# EAGLE design Atomic_V1.0 (EAGLE 9.6.2)
Assembly variants: ECU Type I non terminated

## Sheet 1 of 3
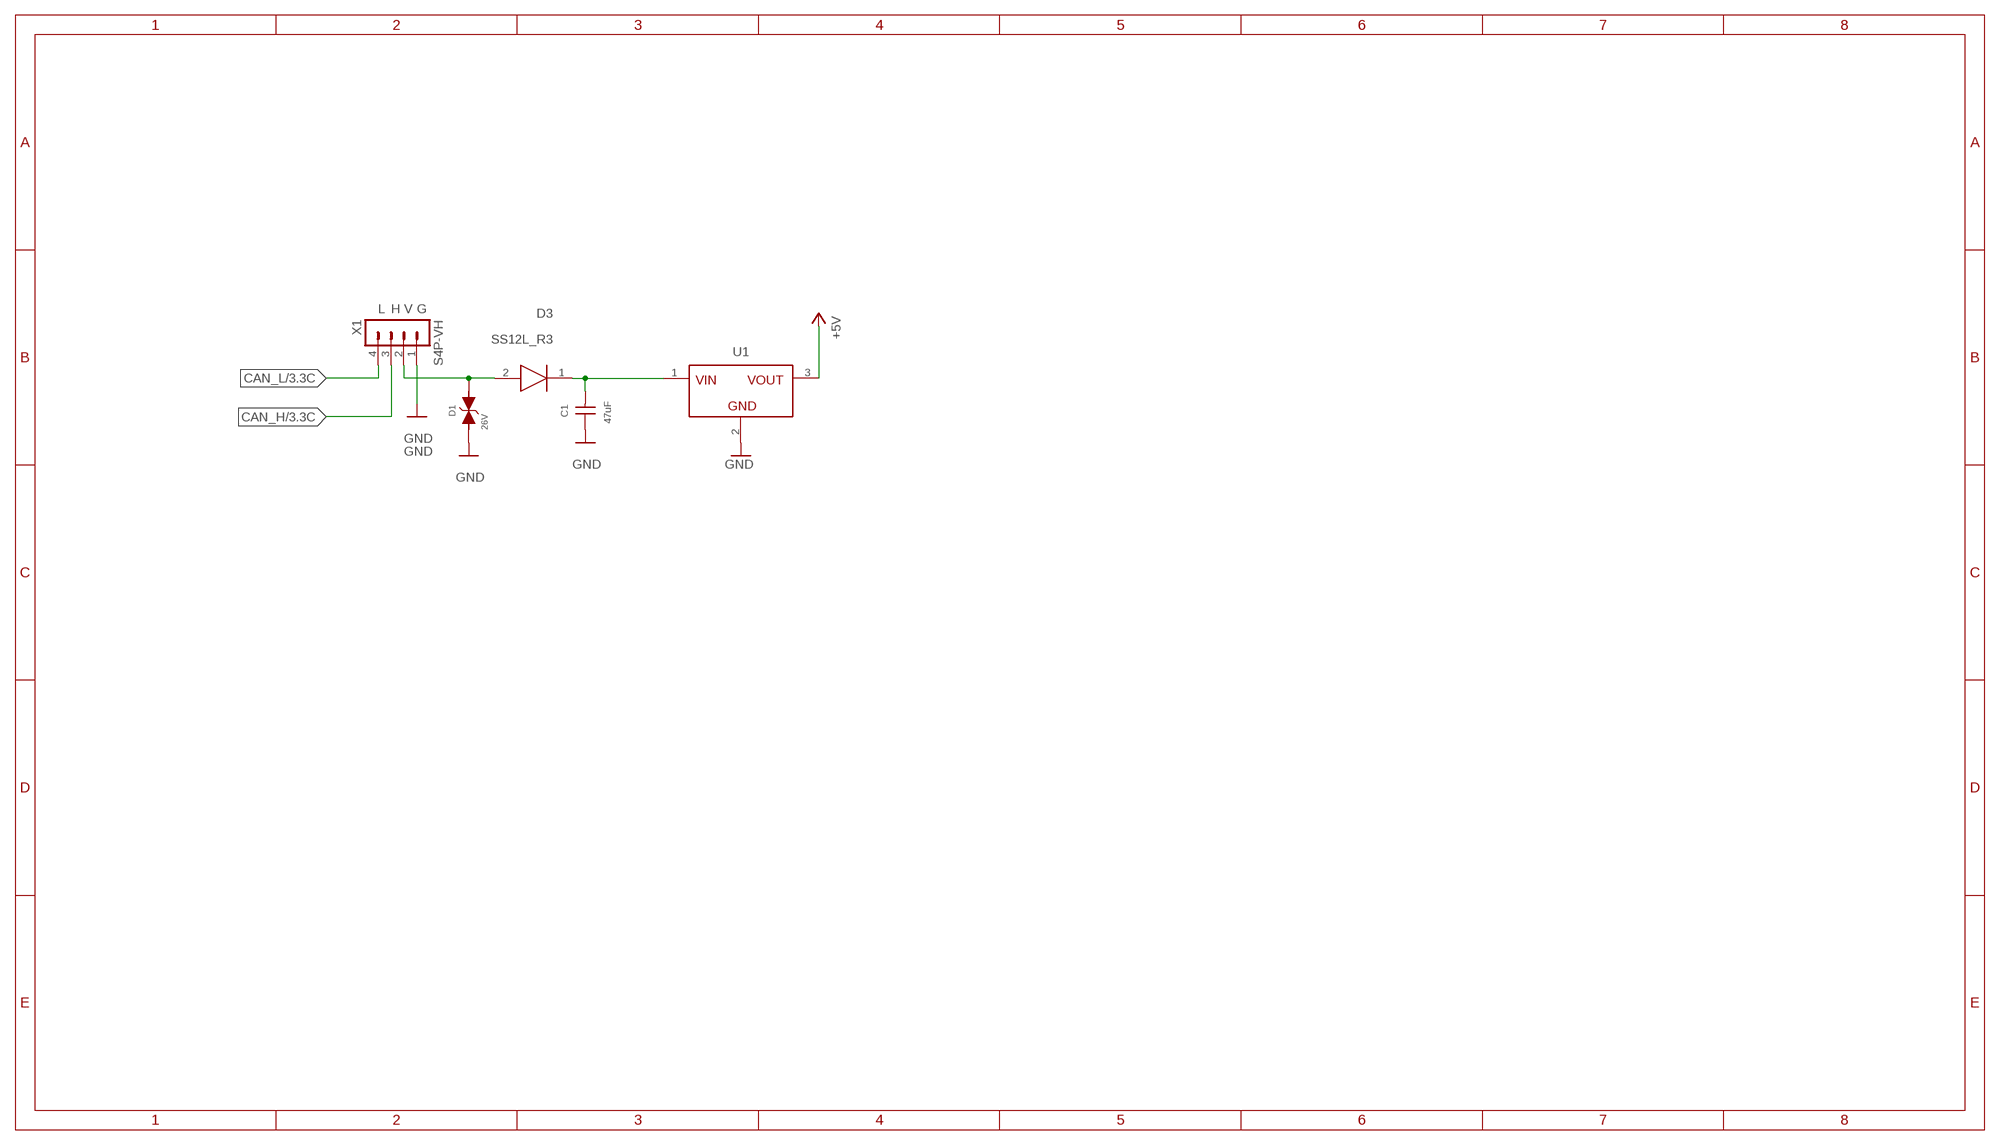
[diagram p0: schematic, sheet 1]

### Parts
C1  47uF  WCAP-CSGP_1210_H2.5_885012109014_25V(DC)  [WCAP-CSGP_1210_H2.5]
D1  26V  WE-TVSP_DO-214AC_400W_BI_824501261  [WE-TVSP_DO-214AC_BIDIRECTIONAL]
D3  SS12L_R3  [SODFL3618X143N]
U1  MAGI³C-FDSM_SIP-3_173010542_173XXXX42  [MAGI³C-FDSM_173XXXX42]
X1  S4P-VH  [S4P-VH]

### Nets
+5V: U1.3(VOUT) ; also sheet 2,3
+12V: D1.2 D3.2(A) X1.2
CAN_H: X1.3 ; also sheet 3
CAN_L: X1.4 ; also sheet 3
GND [GND]: C1.1 D1.1 U1.2(GND) X1.1 ; also sheet 2,3
N$1: C1.2 D3.1(K) U1.1(VIN)

### Notes on the sheet
- L | H | V | G

## Sheet 2 of 3
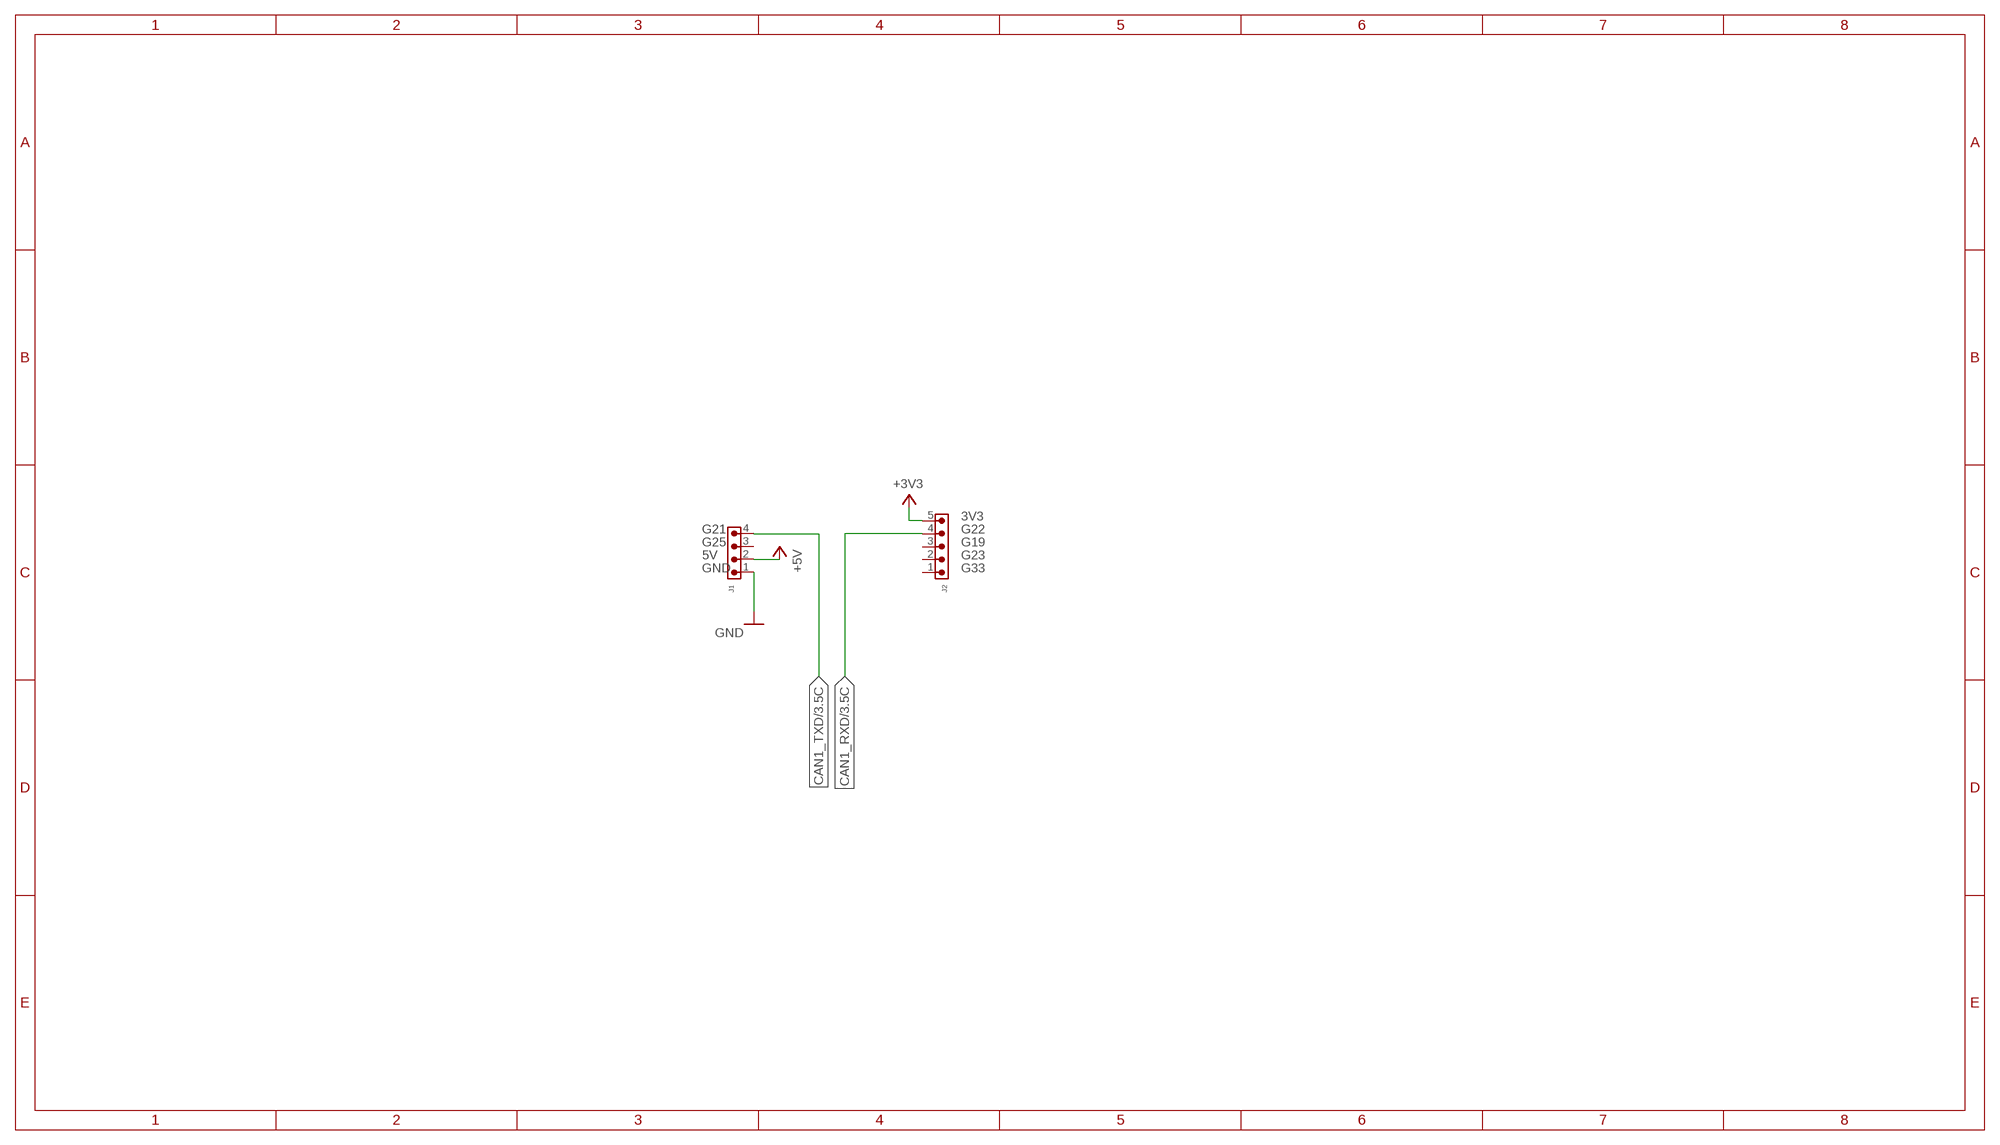
[diagram p1: schematic, sheet 2]

### Parts
J1  6130XX11121_61300411121  [61300411121]
J2  6130XX11121_61300511121  [61300511121]

### Nets
+3V3: J2.5 ; also sheet 3
+5V: J1.2 ; also sheet 1,3
CAN1_RXD: J2.4 ; also sheet 3
CAN1_TXD: J1.4 ; also sheet 3
GND [GND]: J1.1 ; also sheet 1,3
Unconnected: J1.3 J2.1 J2.2 J2.3

### Notes on the sheet
- 3V3
- G21 | G22
- G25 | G19
- 5V | G23
- GND | G33

## Sheet 3 of 3
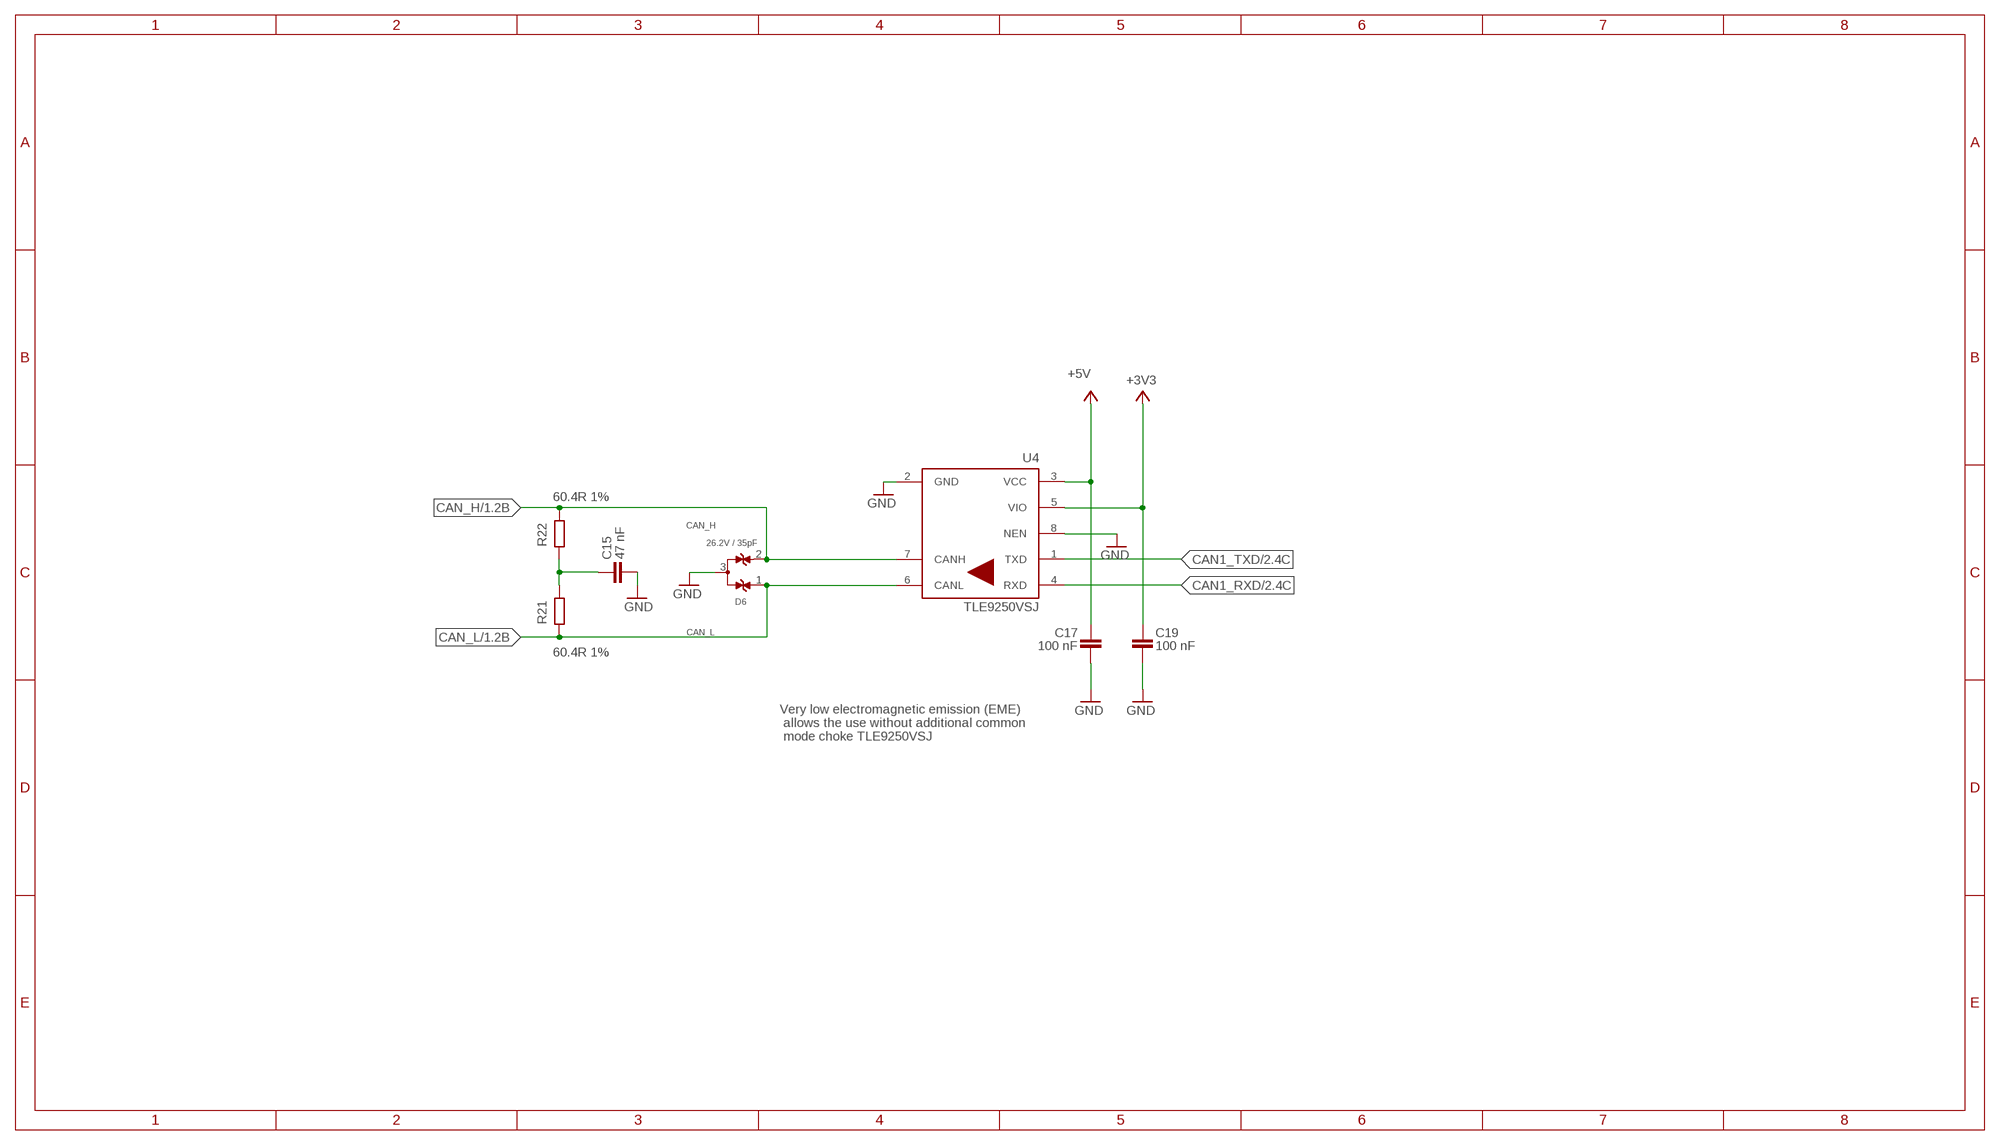
[diagram p2: schematic, sheet 3]

### Parts
C15  47 nF  WCAP-CSGP_0402_885012205054_25V(DC)  [WCAP-CSGP_0402]
C17  100 nF  WCAP-CSGP_0402_885012205037_16V(DC)  [WCAP-CSGP_0402]
C19  100 nF  WCAP-CSGP_0402_885012205037_16V(DC)  [WCAP-CSGP_0402]
D6  26.2V / 35pF  WE-TVS_SOT23-3L_824098024  [WE-TVS_SOT23-3L]
R21  60.4R 1%  R-0402_60.4OHMS_1%_AEC-Q200  [WCAP-CSRF_0402]  (not fitted in variant ECU Type I non terminated)
R22  60.4R 1%  R-0402_60.4OHMS_1%_AEC-Q200  [WCAP-CSRF_0402]  (not fitted in variant ECU Type I non terminated)
U4  TLE9250VSJ  [SOIC127P602X173-8N-V]

### Nets
+3V3: C19.1 U4.5(VIO) ; also sheet 2
+5V: C17.1 U4.3(VCC) ; also sheet 1,2
CAN1_RXD: U4.4(RXD) ; also sheet 2
CAN1_TXD: U4.1(TXD) ; also sheet 2
CAN_H: D6.2 R22.2 U4.7(CANH) ; also sheet 1
CAN_L: D6.1 R21.1 U4.6(CANL) ; also sheet 1
GND [GND]: C15.2 C17.2 C19.2 D6.3 U4.2(GND) U4.8(NEN) ; also sheet 1,2
N$17: C15.1 R21.2 R22.1

### Notes on the sheet
- Very low electromagnetic emission (EME)
   allows the use without additional common
   mode choke TLE9250VSJ

## Library data of the parts
C1 = Wurth_Capacitors_WCAP-CSGP:WCAP-CSGP_1210_H2.5: WCAP-CSGP MLCCs 1210 General Purpose Characteristics General purpose product series High performance ceramic High electrical precision and stability ceramic especially for NP0 Minimal aging especially for NP0 Mounting style: SMT-Chip Ceramic: NP0 (Class I), X5R (Class II), X7R (Class II) Capacitance range: 22 pF ‒ 100 µF Temperature Coefficient: ±30 ppm/°C; ±0.54 % for NP0 ±15 % for X7R and X5R Voltage range (UR): 6.3 ‒ 100 V(DC) Operating temperature: -55 °C up to + 125 °C for NP0 and X7R -55 °C up to + 85 °C for X5R Termination: Cu/Ni/Sn Recommended soldering: Reflow soldering Applications Temperature compensation (NP0) Coupling Decoupling Bypass Smoothing Filtering Resonant circuit <https://www.we-online.com/catalog/media/o166502v209%20Family_WE-MLCC_1210.jpg> Details see: https://www.we-online.com/catalog/en/WCAP-CSGP-1210/ Updated by yingchun,Shan;2020-03-09 2020(C) Würth Elektronik; CERAMIC-TYPE: X5R Class II; DATASHEET-URL: https://www.we-online.com/catalog/datasheet/885012109014.pdf; DF: 0.05; H: 2.5mm; OPERATING-TEMPERATURE: -55 °C up to +85 °C; PART-NUMBER: 885012109014; QMIN: -; RISO: 0,005G Ohm; TECHNICAL-REFERENCE: X5R1210226M025DFCT10000; TOL-VALUE: ±20%; VALUE: 22µF; VR: 25V(DC)
C15 = fliegl-wuerth:WCAP-CSGP_0402: WCAP-CSGP MLCCs 0402 General Purpose Characteristics High performance ceramic High electrical precision and stability ceramic especially for NP0 Minimal aging especially for NP0 Mounting style: SMT-Chip Ceramic: NP0 (Class I), X5R (Class II), X7R (Class II) Capacitance range: 1 pF ‒ 10 µF Temperature Coefficient: ±30 ppm/°C; ±0.54 % for NP0 ±15 % for X5R and X7R Voltage range (UR): 6.3 ‒ 100 V(DC) Operating temperature: -55 °C up to + 125 °C for NP0 and X7R -55 °C up to + 85 °C for X5R Termination: Cu/Ni/Sn Recommended soldering: Reflow soldering Applications Temperature compensation (NP0) Coupling Decoupling Bypass Smoothing Filtering Resonant circuit <https://www.we-online.com/catalog/media/o157810v209%20Family_WE-MLCC_0805_weiss.jpg> Details see: https://www.we-online.com/catalog/en/WCAP-CSGP-0402/ Updated by yingchun,Shan;2020-03-06 2020(C) Würth Elektronik; ARTIKEL_NR: 545508; CERAMIC-TYPE: X7R Class II; PART-NUMBER: 885012205054; TOL-VALUE: ±10%; VR: 25V(DC)
C17 C19 = fliegl-wuerth:WCAP-CSGP_0402: WCAP-CSGP MLCCs 0402 General Purpose Characteristics High performance ceramic High electrical precision and stability ceramic especially for NP0 Minimal aging especially for NP0 Mounting style: SMT-Chip Ceramic: NP0 (Class I), X5R (Class II), X7R (Class II) Capacitance range: 1 pF ‒ 10 µF Temperature Coefficient: ±30 ppm/°C; ±0.54 % for NP0 ±15 % for X5R and X7R Voltage range (UR): 6.3 ‒ 100 V(DC) Operating temperature: -55 °C up to + 125 °C for NP0 and X7R -55 °C up to + 85 °C for X5R Termination: Cu/Ni/Sn Recommended soldering: Reflow soldering Applications Temperature compensation (NP0) Coupling Decoupling Bypass Smoothing Filtering Resonant circuit <https://www.we-online.com/catalog/media/o157810v209%20Family_WE-MLCC_0805_weiss.jpg> Details see: https://www.we-online.com/catalog/en/WCAP-CSGP-0402/ Updated by yingchun,Shan;2020-03-06 2020(C) Würth Elektronik; ARTIKEL_NR: 545504; CERAMIC-TYPE: X7R Class II; PART-NUMBER: 885012205037; TOL-VALUE: ±10%; VR: 16V(DC)
D1 = Wurth_EMC Components_WE-TVSP:WE-TVSP_DO-214AC_400W_BI: WE-TVSP Power TVS Diode Characteristics Low Profile Package Glass passivated Juction Excellent clamping capability Fast response time MSL Level 1, per J-STD-020 Classification of the plastic case: UL 94 V-0 Safety certification UL 497B, E478010 Identical design: - DO-214AC = SMAJ - DO-214AA = SMBJ - DO-214AB = SMCJ/SMDJ Applications Ideal to protect the I/O Interfaces, Bus Voltage and other circuits of sensetive electronic equipment against voltage transiensts <https://katalog.we-online.com/media/images/v2/o55793v209%20WE-TVSP_600W-3000W_D0214AA_4C.jpg> Details see: https://katalog.we-online.com/en/pbs/WE-TVSP Updated by Ella Wu 2019-07-05 2019 (C) Würth Elektronik; DATASHEET-URL: https://katalog.we-online.com/pbs/datasheet/824501261.pdf; IPEAK: 9.5A; MOUNT: SMT; PART-NUMBER: 824501261; PDISS: 400W; VBR: 30.4V; VCLAMP: 42.1V
D3 = SS12L_R3:SS12L_R3: Taiwan Semi SS12L R3, SMT Schottky Diode, 20V 1A, 2-Pin Sub SMA Source: Datasheet <https://componentsearchengine.com/Datasheets/1/SS12L R3.pdf>; DESCRIPTION: Taiwan Semi SS12L R3, SMT Schottky Diode, 20V 1A, 2-Pin Sub SMA; HEIGHT: 1.43mm; MANUFACTURER_NAME: Taiwan Semiconductor; MANUFACTURER_PART_NUMBER: SS12L R3; MOUSER_PART_NUMBER: 821-SS12LR3; MOUSER_PRICE-STOCK: https://www.mouser.com/Search/Refine.aspx?Keyword=821-SS12LR3
D6 = fliegl-wuerth:WE-TVS_SOT23-3L_824098024: WE-TVS TVS Diode  Standard Series Characteristics Fast turn-on Low clamping voltage High ESD withstand voltage Uni- or bidirectional protection Small package Epoxy flame resistant UL94 V-0 Applications DC power supply USB Power Delivery (PD) Headsets and accessories PDAs Digital cameras MP3-Player Touch Panels Notebooks ESD, EFT and Surge Protection ESD protection in accordance with EN 61000-4-2  8 kV contact discharge  15 kV air discharge Application Notes ANP024 The USB Interface from EMC Point of View <https://katalog.we-online.de/media/images/v2/Family_WE-TVS_Standard.jpg> Details see: https://katalog.we-online.de/en/pbs/WE-TVS/82402374?m Created By Yingchun,Shan 2018-11-16 2018 (C) Wurth Elektronik; ARTIKEL_NR: 531887; KOMPONENTENNUMMER: 617684; WE-NUMBER: 824098024
J1 = Wurth_Connectors_WR-PHD:6130XX11121_61300411121: WR-PHD 2.54 mm THT Pin Header ARTICLE PROPERTIES: Pins:1;​ 2;​ 3;​ 4;​ 5;​ 6;​ 7;​ 8;​ 9;​ 10;​ 12;​ 13;​ 14;​ 15;​ 16;​ 18;​ 20;​ 22;​ 24;​ 25;​ 32;​ 36;​ 40 KIND PROPERTIES: Pitch：2.54 mm Quality Class:3 as per CECC 75 301-802 Rows：Single Gender：Pin Header Type：Straight MATERIAL PROPERTIES: Insulator Material :PBT Insulator Flammability Rating:UL94 V-0 Contact Material:Copper Alloy Contact Plating:Gold Contact Type:Stamped GENERAL INFORMATION Operating Temperature:-40 up to +105 °C Compliance:RoHS ELECTRICAL PROPERTIES: Rated Current:3 A IR 1:3 A Withstanding Voltage:500 V (AC) Contact Resistance:20 mΩ RISO:1000 MΩ CERTIFICATION UL Approval:E323964 PACKAGING PROPERTIES Packaging:Bag <https://katalog.we-online.com/media/images/v2/o33211v209%20Family_BTB_PHD_6130xx11121.jpg> Details see: https://katalog.we-online.com/en/em/PHD_2_54_THT_PIN_HEADER_6130XX11121 Updated by Yingchun,Shan 2019-10-16 2019 (C) Würth Elektronik; DATASHEET-URL: https://katalog.we-online.com/em/datasheet/61300411121.pdf; GENDER: Pin Header; IR: 3A; MATES: WR-PHD 2.54mm Angled Socket Header /SMT Socket Header/Socket Header; PACKAGING: Bag; PART-NUMBER: 61300411121; PINS: 4; ROWS: Single; TYPE: Straight
J2 = Wurth_Connectors_WR-PHD:6130XX11121_61300511121: WR-PHD 2.54 mm THT Pin Header ARTICLE PROPERTIES: Pins:1;​ 2;​ 3;​ 4;​ 5;​ 6;​ 7;​ 8;​ 9;​ 10;​ 12;​ 13;​ 14;​ 15;​ 16;​ 18;​ 20;​ 22;​ 24;​ 25;​ 32;​ 36;​ 40 KIND PROPERTIES: Pitch：2.54 mm Quality Class:3 as per CECC 75 301-802 Rows：Single Gender：Pin Header Type：Straight MATERIAL PROPERTIES: Insulator Material :PBT Insulator Flammability Rating:UL94 V-0 Contact Material:Copper Alloy Contact Plating:Gold Contact Type:Stamped GENERAL INFORMATION Operating Temperature:-40 up to +105 °C Compliance:RoHS ELECTRICAL PROPERTIES: Rated Current:3 A IR 1:3 A Withstanding Voltage:500 V (AC) Contact Resistance:20 mΩ RISO:1000 MΩ CERTIFICATION UL Approval:E323964 PACKAGING PROPERTIES Packaging:Bag <https://katalog.we-online.com/media/images/v2/o33211v209%20Family_BTB_PHD_6130xx11121.jpg> Details see: https://katalog.we-online.com/en/em/PHD_2_54_THT_PIN_HEADER_6130XX11121 Updated by Yingchun,Shan 2019-10-16 2019 (C) Würth Elektronik; DATASHEET-URL: https://katalog.we-online.com/em/datasheet/61300511121.pdf; GENDER: Pin Header; IR: 3A; MATES: WR-PHD 2.54mm Angled Socket Header /SMT Socket Header/Socket Header; PACKAGING: Bag; PART-NUMBER: 61300511121; PINS: 5; ROWS: Single; TYPE: Straight
R21 R22 = Resistor_smaller_fliegl:R-0402_: RESISTOR, European symbol; ARTIKEL_NR: 546940; N: SMD 0402 60.4ohms 1% AEC-Q200
U1 = Wurth_Step Down Converter_MagI³C-FDSM:MAGI³C-FDSM_SIP-3: MagI³C-FDSM Fixed Step Down Regulator Module Characteristics Simplest design (no power supply knowledge required) Leaded through-hole package for easy manufacturing and prototyping Stand alone solution (CIN and COUT integrated, no external components) L78x series linear regulator replacement (no heatsink required) Low conducted and radiated EMI (compliant to EN55022 class B) Applications Point-of-Load from 24V, 18V, 15V, 12V, 9V rail Replacement for linear regulators Interface and microcontroller supply Industrial, Test & Measurement, Medical applications System power supplies <https://katalog.we-online.com/media/images/v2/o55808v209%20FDSM_MagI3C_173010378_4C.jpg> Details see: https://www.we-online.de/katalog/en/MAGIC_FDSM_FIXED_OUTPUT_VOLTAGE/ Updated by Ella Wu 2020-03-17 2020 (C) Würth Elektronik; DATASHEET-URL: https://www.we-online.de/katalog/datasheet/173010542.pdf; I-OUTPUT: 1A; MOUNT: THT; PART-NUMBER: 173010542; V-INPUT: 8-42V; V-OUTPUT: 5V
U4 = TLE9250VSJ:TLE9250VSJ: TLE9250VSJ SOIC127P602X173-8N-V High Speed CAN FD Transceiver; ARTIKEL_NR: 545599
X1 = con-JST VH:S4P-VH: JST VH Series header 3.96mm pitch disconnectable crimp style connectors, horizontal (side entry type), 4 pins

## Net classes
1 GND: width 0.127 mm, clearance 0.127 mm to class 0

## Board
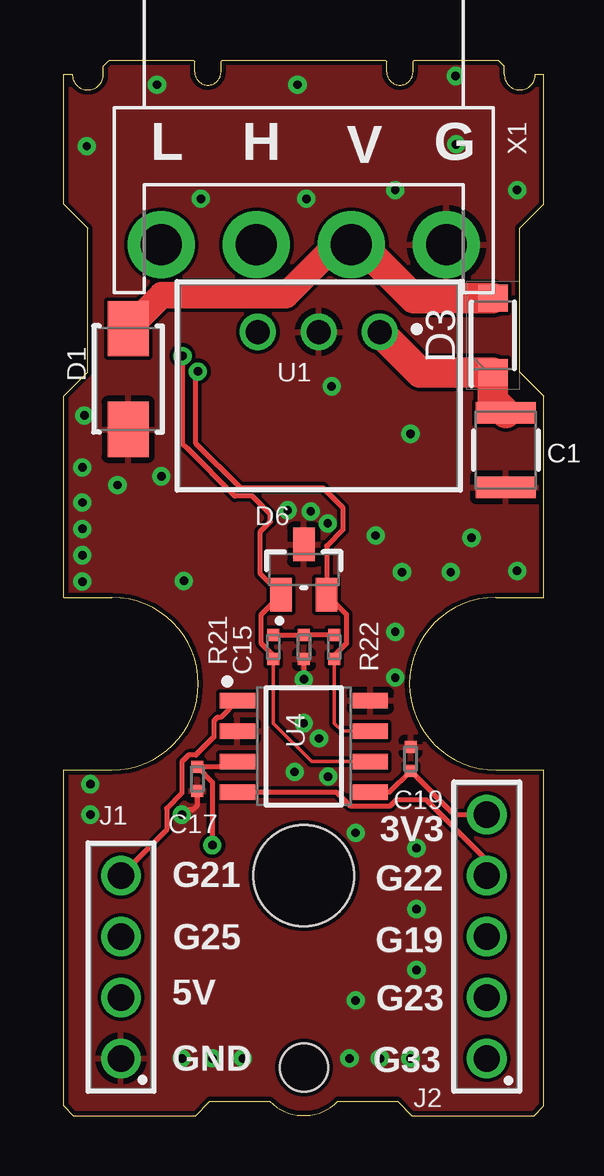
[diagram p3: board, top side]
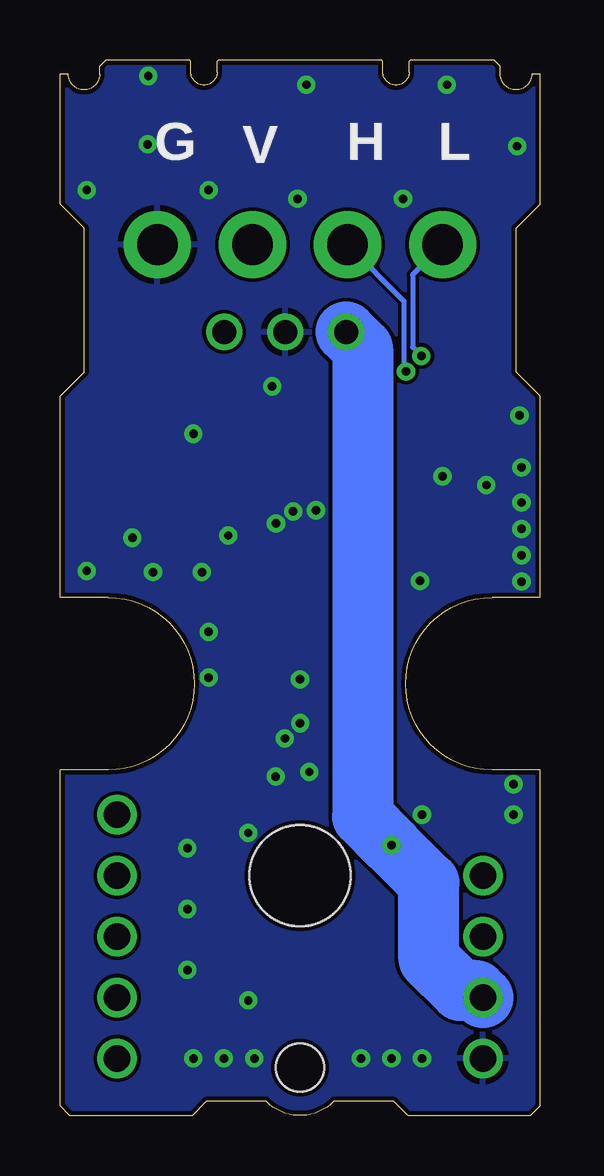
[diagram p4: board, bottom side, seen from below]

Size 20 x 44 mm. Coordinates in mm from the lower left corner, seen from the top.
Outline: 8.59,0.59 arc90 11.41,0.59
Outline: 11.41,0.59 11.41,0.59
Outline: 11.41,0.59 13.91,0.59 14.5,0 19.6,0 20,0.4 20,14.4 18,14.4 arc-180 18,21.6 20,21.6 20,30 19,31 19,37 20,38 20,43.4 19.65,43.4 arc-180 18.35,43.4 18.35,43.75 18.1,44 14.6,44 14.55,43.95 14.55,43.5 arc-180 13.45,43.5 13.45,43.95 13.4,44 6.6,44 6.55,43.95 6.55,43.5 arc-180 5.45,43.5 5.45,43.95 5.4,44 1.9,44 1.65,43.75 1.65,43.4 arc-180 0.35,43.4 0,43.4 0,38 1,37 1,31 0,30 0,21.6 2,21.6 arc-180 2,14.4 0,14.4 0,0.4 0.4,0 5.5,0 6.09,0.59 8.59,0.59
Outline: 8.59,0.59 8.59,0.59
Copper layers (1*16): Top 0.035mm / dielectric 1.5mm / Bottom 0.035mm
Design rules "default *": minimum track width 6mil, minimum drill 0.3mm, track to track 6mil, track to pad 6mil, pad to pad 6mil, via to via 6mil, smd to smd 6mil, copper to edge 0.2mm, drill to drill 6mil, minimum pad ring 10mil, minimum via ring 8mil, stop-mask expansion 4mil, vias tented up to drill 0.4mm, thermal gap 10mil
Holes 4.2 mm at 10,10
Holes 2 mm at 10,2
bKeepout: area -0.4,22.8 to 6,29.2; area 14.2,22.8 to 20.6,29.2

### Footprints (pad centres in the part's own frame; a part is rotated, then mirrored left to right if it is on the bottom)
WCAP-CSGP_1210_H2.5 = smd 0.9 x 2.5: 1 -1.55,0; 2 1.55,0
WCAP-CSGP_0402 = smd 0.5 x 0.5: 1 -0.5,0; 2 0.5,0
WE-TVSP_DO-214AC_BIDIRECTIONAL = smd 2.3 x 1.7: 1 -2.1,0; 2 2.1,0
SODFL3618X143N = smd 1.12 x 1.22: 1 -1.55,0; 2 1.55,0
WE-TVS_SOT23-3L = smd 1.4 x 0.9: 1 -1.05,0.95; 2 -1.05,-0.95; 3 1.05,0
61300411121 = drill 1.1: 1 -3.81,0; 2 -1.27,0; 3 1.27,0; 4 3.81,0
61300511121 = drill 1.1: 1 -5.08,0; 2 -2.54,0; 3 0,0; 4 2.54,0; 5 5.08,0
WCAP-CSRF_0402 = smd 0.5 x 0.5: 1 0.5,0; 2 -0.5,0
MAGI³C-FDSM_173XXXX42 = drill 1: 1 -2.54,0; 2 0,0; 3 2.54,0
SOIC127P602X173-8N-V = smd 1.47 x 0.65: 1 -2.765,1.905; 2 -2.765,0.635; 3 -2.765,-0.635; 4 -2.765,-1.905; 5 2.765,-1.905; 6 2.765,-0.635; 7 2.765,0.635; 8 2.765,1.905
S4P-VH = drill 1.7 pad 2.794: 1 -5.94,0; 2 -1.98,0; 3 1.98,0; 4 5.94,0

### Placement (x,y rotation side)
C1  18.42,27.74 90 top
C15  10,19.52 270 top
C17  5.55,14.02 270 top
C19  14.45,14.86 90 top
D1  2.68,30.7 90 top
D3  17.88,32.52 90 top
D6  10,22.76 90 top
J1  2.38,6.19 90 top
J2  17.62,7.46 90 top
R21  8.73,19.52 270 top
R22  11.27,19.52 90 top
U1  10.62,32.66 180 top
U4  10,15.39 0 top
X1  10,36.3 180 top

### Tracks (layer width: path | path; a pad name or v marks a point on that pad's centre or on a via)
+3V3
  Top 0.2: U4.5 13.57,13.48 C19.1 16.27,12.54 J2.5
+5V  (via drill 0.35)
  Top 0.2: U4.3 7,14.52 C17.1 6.19,13.89 v6.19,11.27
  Bottom 2.54: J1.2 2.67,5.21 3.31,5.21 4.63,6.53 4.63,9.71 v6.19,11.27 7.39,12.47 7.39,31.97 U1.3
+12V
  Top 1.1: D1.2 4.08,34.2 9.26,34.2 11.36,36.3 X1.2
  Top 1.27: X1.2 12.35,36.3 14.58,34.07 D3.2
CAN1_RXD
  Top 0.2: U4.4 11.35,13.48 11.93,12.91 13.61,12.91 13.87,13.18 15.08,13.18 17.62,10.64 J2.4
CAN1_TXD
  Top 0.2: U4.1 6.54,16.6 6.39,16.6 6.25,16.45 6.25,15.77 5.5,15.03 5.2,15.03 4.92,14.75 4.92,13.44 4.29,12.8 4.29,11.91 J1.4
CAN_H  (via drill 0.35)
  Top 0.152: R22.2 11.27,16.35 11.59,16.02 U4.7
  Top 0.2: R22.2 11.27,19.17 11.77,19.67 11.77,20.89 D6.2 10.95,23.74 11.63,24.42 11.63,25.34 10.8,26.17 7.35,26.17 5.48,28.04 5.48,30.92 v5.58,31.02
  Bottom 0.2: X1.3 5.67,33.95 5.67,31.11 v5.58,31.02
CAN_L  (via drill 0.35)
  Top 0.152: R21.1 8.73,16.35 10.32,14.75 U4.6
  Top 0.2: R21.1 8.73,19.17 8.23,19.67 8.23,20.89 D6.1 8.19,22.57 8.19,24.35 8.6,24.76 8.6,25.07 7.86,25.82 7.13,25.82 5.13,27.81 4.94,28 v4.94,31.66
  Bottom 0.2: X1.4 5.31,35.05 5.31,32.03 v4.94,31.66
GND  (via drill 0.35)
  Top 0.2: C15.2 v10,18.18 | C17.2 5.55,12.92 5.37,12.73 5.1,12.73 v4.92,12.54
  other vias: 1.11,13.81 1.11,12.54 4.92,2.38 6.19,2.38 7.46,2.38 11.9,2.38 13.17,2.38 14.44,2.38 10,16.35 9.62,14.32 13.81,18.26 18.89,22.7 16.35,40.48 18.89,38.58 11,24.68 13.81,38.58 16.12,22.65 14.44,28.42 11.16,30.4 13.81,20.16 10.63,15.72 11.01,14.13 12.16,11.78 14.7,11.15 14.7,8.61 14.7,6.07 12.16,4.8 16.99,24.09 0.85,29.18 5,22.29 14.09,22.65 0.77,22.26 0.77,23.35 0.77,24.45 0.77,25.55 0.77,27.01 2.23,26.28 4.06,26.65 9.33,25.23 10.29,25.18 10.1,38.21 5.71,38.21 0.95,40.41 3.88,42.97 9.74,42.97 16.32,43.34 12.99,24.18
  pour Top: -2.07,44.29 21.43,44.29 21.43,-0.79 -2.07,-0.79
  pour Bottom: -2.07,44.29 21.43,44.29 21.43,-0.79 -2.07,-0.79
N$1
  Top 1.27: C1.2 17.88,29.83 D3.1 14.86,30.97 U1.1
N$17
  Top 0.2: R21.2 C15.1 R22.1

### Text on the board
tPlace: L | H | V | G | 3V3 | G21 | G22 | G25 | G19 | 5V | G23 | GND | G33
bNames: L | H | V | G